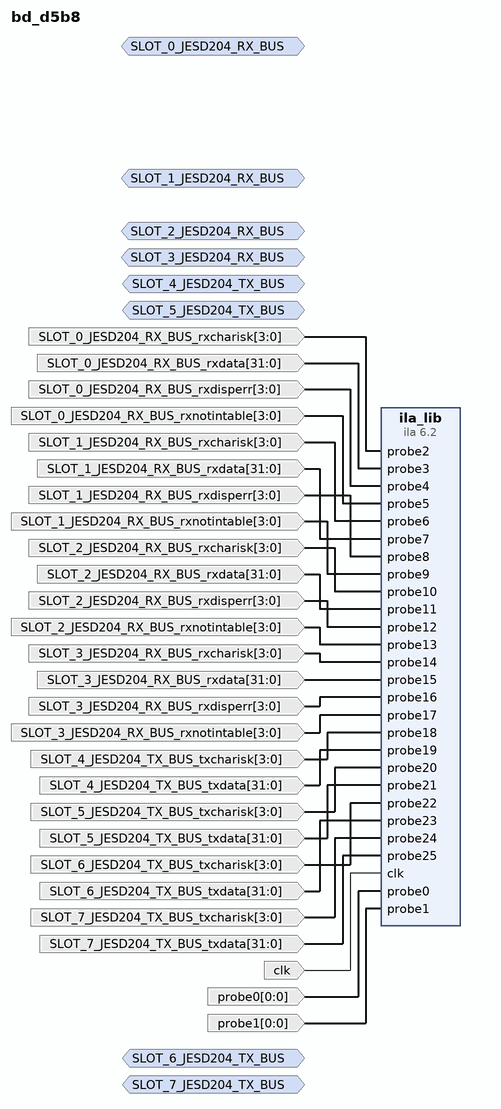
[diagram p0: block diagram of the top level]
# Vivado block design bd_d5b8, xc7z045ffg900-2, Vivado 2022.2
create_bd_design bd_d5b8

create_bd_intf_port -mode Monitor -vlnv xilinx.com:display_jesd204:jesd204_rx_bus_rtl:1.0 SLOT_0_JESD204_RX_BUS
create_bd_intf_port -mode Monitor -vlnv xilinx.com:display_jesd204:jesd204_rx_bus_rtl:1.0 SLOT_1_JESD204_RX_BUS
create_bd_intf_port -mode Monitor -vlnv xilinx.com:display_jesd204:jesd204_rx_bus_rtl:1.0 SLOT_2_JESD204_RX_BUS
create_bd_intf_port -mode Monitor -vlnv xilinx.com:display_jesd204:jesd204_rx_bus_rtl:1.0 SLOT_3_JESD204_RX_BUS
create_bd_intf_port -mode Monitor -vlnv xilinx.com:display_jesd204:jesd204_tx_bus_rtl:1.0 SLOT_4_JESD204_TX_BUS
create_bd_intf_port -mode Monitor -vlnv xilinx.com:display_jesd204:jesd204_tx_bus_rtl:1.0 SLOT_5_JESD204_TX_BUS
create_bd_intf_port -mode Monitor -vlnv xilinx.com:display_jesd204:jesd204_tx_bus_rtl:1.0 SLOT_6_JESD204_TX_BUS
create_bd_intf_port -mode Monitor -vlnv xilinx.com:display_jesd204:jesd204_tx_bus_rtl:1.0 SLOT_7_JESD204_TX_BUS
create_bd_port -dir I -type clk clk
create_bd_port -dir I -from 0 -to 0 probe0
create_bd_port -dir I -from 0 -to 0 probe1
create_bd_port -dir I -from 3 -to 0 SLOT_0_JESD204_RX_BUS_rxcharisk
create_bd_port -dir I -from 31 -to 0 SLOT_0_JESD204_RX_BUS_rxdata
create_bd_port -dir I -from 3 -to 0 SLOT_0_JESD204_RX_BUS_rxdisperr
create_bd_port -dir I -from 3 -to 0 SLOT_0_JESD204_RX_BUS_rxnotintable
create_bd_port -dir I -from 3 -to 0 SLOT_1_JESD204_RX_BUS_rxcharisk
create_bd_port -dir I -from 31 -to 0 SLOT_1_JESD204_RX_BUS_rxdata
create_bd_port -dir I -from 3 -to 0 SLOT_1_JESD204_RX_BUS_rxdisperr
create_bd_port -dir I -from 3 -to 0 SLOT_1_JESD204_RX_BUS_rxnotintable
create_bd_port -dir I -from 3 -to 0 SLOT_2_JESD204_RX_BUS_rxcharisk
create_bd_port -dir I -from 31 -to 0 SLOT_2_JESD204_RX_BUS_rxdata
create_bd_port -dir I -from 3 -to 0 SLOT_2_JESD204_RX_BUS_rxdisperr
create_bd_port -dir I -from 3 -to 0 SLOT_2_JESD204_RX_BUS_rxnotintable
create_bd_port -dir I -from 3 -to 0 SLOT_3_JESD204_RX_BUS_rxcharisk
create_bd_port -dir I -from 31 -to 0 SLOT_3_JESD204_RX_BUS_rxdata
create_bd_port -dir I -from 3 -to 0 SLOT_3_JESD204_RX_BUS_rxdisperr
create_bd_port -dir I -from 3 -to 0 SLOT_3_JESD204_RX_BUS_rxnotintable
create_bd_port -dir I -from 3 -to 0 SLOT_4_JESD204_TX_BUS_txcharisk
create_bd_port -dir I -from 31 -to 0 SLOT_4_JESD204_TX_BUS_txdata
create_bd_port -dir I -from 3 -to 0 SLOT_5_JESD204_TX_BUS_txcharisk
create_bd_port -dir I -from 31 -to 0 SLOT_5_JESD204_TX_BUS_txdata
create_bd_port -dir I -from 3 -to 0 SLOT_6_JESD204_TX_BUS_txcharisk
create_bd_port -dir I -from 31 -to 0 SLOT_6_JESD204_TX_BUS_txdata
create_bd_port -dir I -from 3 -to 0 SLOT_7_JESD204_TX_BUS_txcharisk
create_bd_port -dir I -from 31 -to 0 SLOT_7_JESD204_TX_BUS_txdata

create_bd_cell -type ip -vlnv xilinx.com:ip:ila:6.2 ila_lib
set_property -dict [list \
  CONFIG.ALL_PROBE_SAME_MU TRUE \
  CONFIG.ALL_PROBE_SAME_MU_CNT 1 \
  CONFIG.C_ADV_TRIGGER FALSE \
  CONFIG.C_DATA_DEPTH 1024 \
  CONFIG.C_EN_STRG_QUAL 0 \
  CONFIG.C_EN_TIME_TAG 0 \
  CONFIG.C_ILA_CLK_FREQ 250000000 \
  CONFIG.C_INPUT_PIPE_STAGES 0 \
  CONFIG.C_MONITOR_TYPE Native \
  CONFIG.C_NUM_OF_PROBES 26 \
  CONFIG.C_PROBE0_MU_CNT 1 \
  CONFIG.C_PROBE0_TYPE 0 \
  CONFIG.C_PROBE0_WIDTH 1 \
  CONFIG.C_PROBE10_TYPE 0 \
  CONFIG.C_PROBE10_WIDTH 4 \
  CONFIG.C_PROBE11_TYPE 0 \
  CONFIG.C_PROBE11_WIDTH 32 \
  CONFIG.C_PROBE12_TYPE 0 \
  CONFIG.C_PROBE12_WIDTH 4 \
  CONFIG.C_PROBE13_TYPE 0 \
  CONFIG.C_PROBE13_WIDTH 4 \
  CONFIG.C_PROBE14_TYPE 0 \
  CONFIG.C_PROBE14_WIDTH 4 \
  CONFIG.C_PROBE15_TYPE 0 \
  CONFIG.C_PROBE15_WIDTH 32 \
  CONFIG.C_PROBE16_TYPE 0 \
  CONFIG.C_PROBE16_WIDTH 4 \
  CONFIG.C_PROBE17_TYPE 0 \
  CONFIG.C_PROBE17_WIDTH 4 \
  CONFIG.C_PROBE18_TYPE 0 \
  CONFIG.C_PROBE18_WIDTH 4 \
  CONFIG.C_PROBE19_TYPE 0 \
  CONFIG.C_PROBE19_WIDTH 32 \
  CONFIG.C_PROBE1_MU_CNT 1 \
  CONFIG.C_PROBE1_TYPE 0 \
  CONFIG.C_PROBE1_WIDTH 1 \
  CONFIG.C_PROBE20_TYPE 0 \
  CONFIG.C_PROBE20_WIDTH 4 \
  CONFIG.C_PROBE21_TYPE 0 \
  CONFIG.C_PROBE21_WIDTH 32 \
  CONFIG.C_PROBE22_TYPE 0 \
  CONFIG.C_PROBE22_WIDTH 4 \
  CONFIG.C_PROBE23_TYPE 0 \
  CONFIG.C_PROBE23_WIDTH 32 \
  CONFIG.C_PROBE24_TYPE 0 \
  CONFIG.C_PROBE24_WIDTH 4 \
  CONFIG.C_PROBE25_TYPE 0 \
  CONFIG.C_PROBE25_WIDTH 32 \
  CONFIG.C_PROBE2_TYPE 0 \
  CONFIG.C_PROBE2_WIDTH 4 \
  CONFIG.C_PROBE3_TYPE 0 \
  CONFIG.C_PROBE3_WIDTH 32 \
  CONFIG.C_PROBE4_TYPE 0 \
  CONFIG.C_PROBE4_WIDTH 4 \
  CONFIG.C_PROBE5_TYPE 0 \
  CONFIG.C_PROBE5_WIDTH 4 \
  CONFIG.C_PROBE6_TYPE 0 \
  CONFIG.C_PROBE6_WIDTH 4 \
  CONFIG.C_PROBE7_TYPE 0 \
  CONFIG.C_PROBE7_WIDTH 32 \
  CONFIG.C_PROBE8_TYPE 0 \
  CONFIG.C_PROBE8_WIDTH 4 \
  CONFIG.C_PROBE9_TYPE 0 \
  CONFIG.C_PROBE9_WIDTH 4 \
  CONFIG.C_TIME_TAG_WIDTH 32 \
  CONFIG.C_TRIGIN_EN false \
  CONFIG.C_TRIGOUT_EN false \
  CONFIG.C_XLNX_HW_PROBE_INFO DEFAULT \
] [get_bd_cells ila_lib]

# ---- connections ----

connect_bd_net [get_bd_ports SLOT_0_JESD204_RX_BUS_rxcharisk] [get_bd_pins ila_lib/probe2]
connect_bd_net [get_bd_ports SLOT_0_JESD204_RX_BUS_rxdata] [get_bd_pins ila_lib/probe3]
connect_bd_net [get_bd_ports SLOT_0_JESD204_RX_BUS_rxdisperr] [get_bd_pins ila_lib/probe4]
connect_bd_net [get_bd_ports SLOT_0_JESD204_RX_BUS_rxnotintable] [get_bd_pins ila_lib/probe5]
connect_bd_net [get_bd_ports SLOT_1_JESD204_RX_BUS_rxcharisk] [get_bd_pins ila_lib/probe6]
connect_bd_net [get_bd_ports SLOT_1_JESD204_RX_BUS_rxdata] [get_bd_pins ila_lib/probe7]
connect_bd_net [get_bd_ports SLOT_1_JESD204_RX_BUS_rxdisperr] [get_bd_pins ila_lib/probe8]
connect_bd_net [get_bd_ports SLOT_1_JESD204_RX_BUS_rxnotintable] [get_bd_pins ila_lib/probe9]
connect_bd_net [get_bd_ports SLOT_2_JESD204_RX_BUS_rxcharisk] [get_bd_pins ila_lib/probe10]
connect_bd_net [get_bd_ports SLOT_2_JESD204_RX_BUS_rxdata] [get_bd_pins ila_lib/probe11]
connect_bd_net [get_bd_ports SLOT_2_JESD204_RX_BUS_rxdisperr] [get_bd_pins ila_lib/probe12]
connect_bd_net [get_bd_ports SLOT_2_JESD204_RX_BUS_rxnotintable] [get_bd_pins ila_lib/probe13]
connect_bd_net [get_bd_ports SLOT_3_JESD204_RX_BUS_rxcharisk] [get_bd_pins ila_lib/probe14]
connect_bd_net [get_bd_ports SLOT_3_JESD204_RX_BUS_rxdata] [get_bd_pins ila_lib/probe15]
connect_bd_net [get_bd_ports SLOT_3_JESD204_RX_BUS_rxdisperr] [get_bd_pins ila_lib/probe16]
connect_bd_net [get_bd_ports SLOT_3_JESD204_RX_BUS_rxnotintable] [get_bd_pins ila_lib/probe17]
connect_bd_net [get_bd_ports SLOT_4_JESD204_TX_BUS_txcharisk] [get_bd_pins ila_lib/probe18]
connect_bd_net [get_bd_ports SLOT_4_JESD204_TX_BUS_txdata] [get_bd_pins ila_lib/probe19]
connect_bd_net [get_bd_ports SLOT_5_JESD204_TX_BUS_txcharisk] [get_bd_pins ila_lib/probe20]
connect_bd_net [get_bd_ports SLOT_5_JESD204_TX_BUS_txdata] [get_bd_pins ila_lib/probe21]
connect_bd_net [get_bd_ports SLOT_6_JESD204_TX_BUS_txcharisk] [get_bd_pins ila_lib/probe22]
connect_bd_net [get_bd_ports SLOT_6_JESD204_TX_BUS_txdata] [get_bd_pins ila_lib/probe23]
connect_bd_net [get_bd_ports SLOT_7_JESD204_TX_BUS_txcharisk] [get_bd_pins ila_lib/probe24]
connect_bd_net [get_bd_ports SLOT_7_JESD204_TX_BUS_txdata] [get_bd_pins ila_lib/probe25]
connect_bd_net [get_bd_ports clk] [get_bd_pins ila_lib/clk]
connect_bd_net -net probe0_1 [get_bd_ports probe0] [get_bd_pins ila_lib/probe0]
connect_bd_net -net probe1_1 [get_bd_ports probe1] [get_bd_pins ila_lib/probe1]

validate_bd_design
save_bd_design
